# EAGLE schematic DoomPlayer (EAGLE 9.6.2)
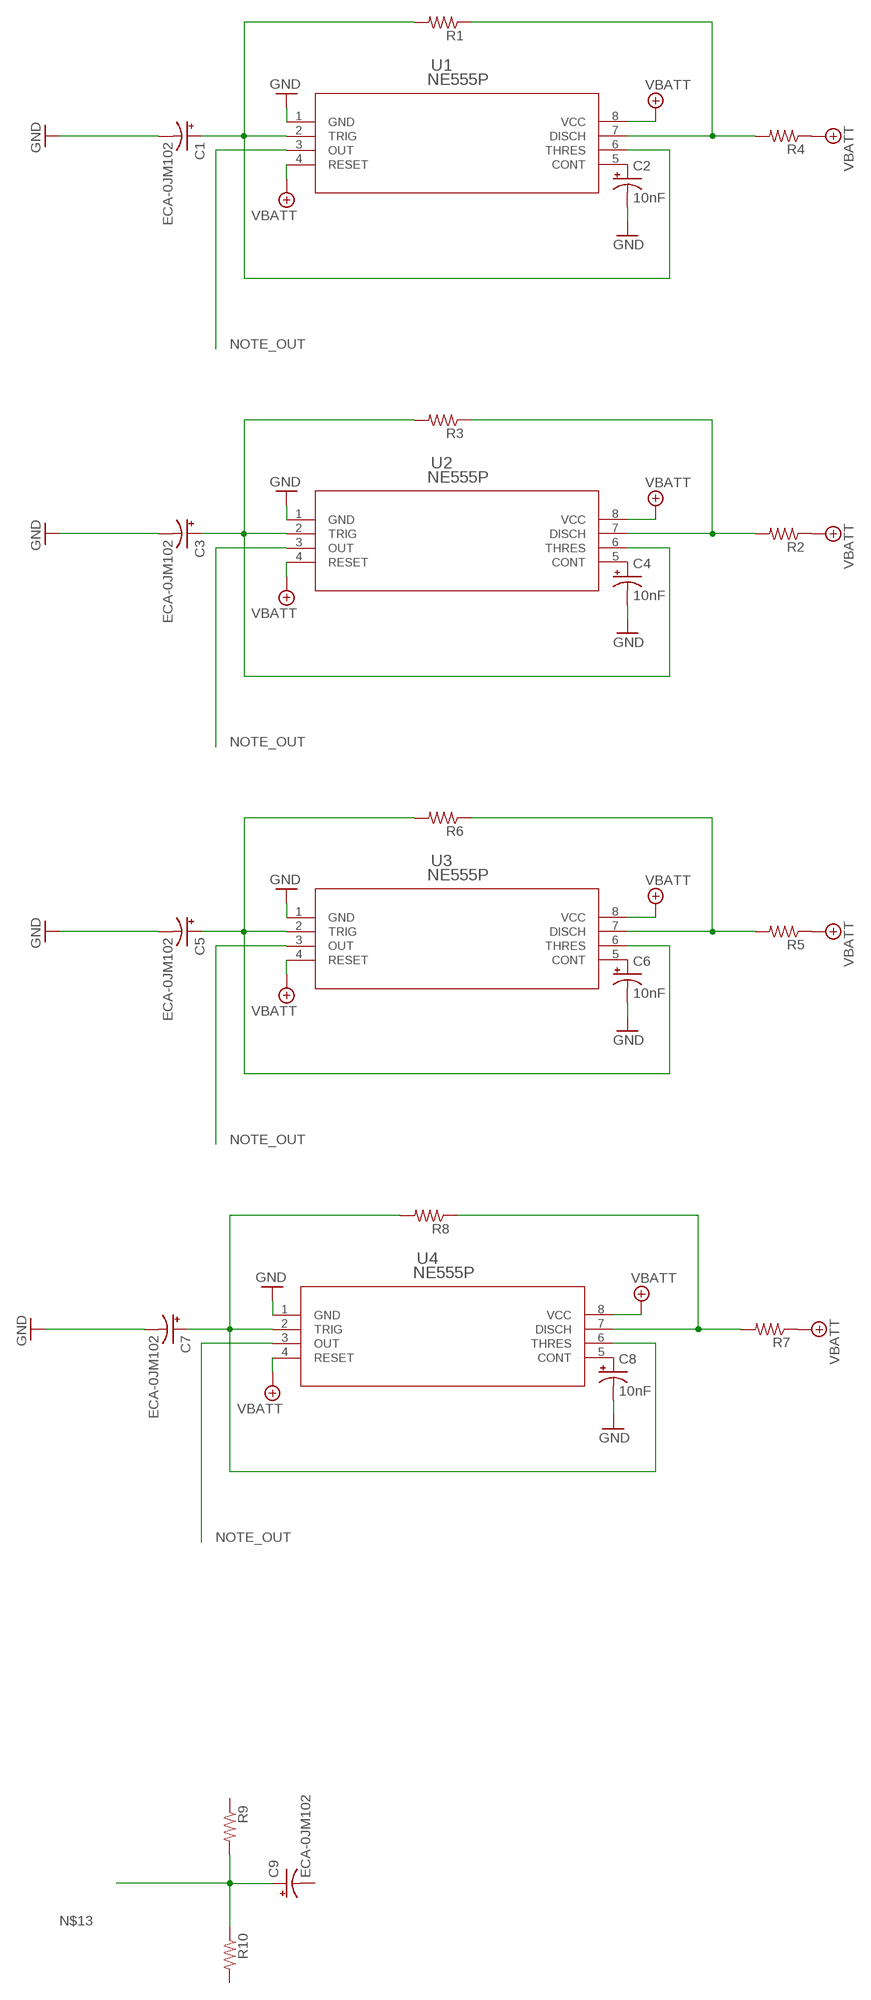
[diagram p0: schematic, sheet 1]

## Parts
C1  ECA-0JM102  [PCAP_8X112]
C2  10nF  ECA-0JM102  [PCAP_8X112]
C3  ECA-0JM102  [PCAP_8X112]
C4  10nF  ECA-0JM102  [PCAP_8X112]
C5  ECA-0JM102  [PCAP_8X112]
C6  10nF  ECA-0JM102  [PCAP_8X112]
C7  ECA-0JM102  [PCAP_8X112]
C8  10nF  ECA-0JM102  [PCAP_8X112]
C9  ECA-0JM102  [PCAP_8X112]
R1  ERJ-L06KF50MV  [RC0805N]
R2  ERJ-L06KF50MV  [RC0805N]
R3  ERJ-L06KF50MV  [RC0805N]
R4  ERJ-L06KF50MV  [RC0805N]
R5  ERJ-L06KF50MV  [RC0805N]
R6  ERJ-L06KF50MV  [RC0805N]
R7  ERJ-L06KF50MV  [RC0805N]
R8  ERJ-L06KF50MV  [RC0805N]
R9  ERJ-L06KF50MV  [RC0805N]
R10  ERJ-L06KF50MV  [RC0805N]
U1  NE555P  [P8]
U2  NE555P  [P8]
U3  NE555P  [P8]
U4  NE555P  [P8]

## Nets
GND: C1.2(-) C2.2(-) C3.2(-) C4.2(-) C5.2(-) C6.2(-) C7.2(-) C8.2(-) U1.1(GND) U2.1(GND) U3.1(GND) U4.1(GND)
N$1: C3.1(+) R3.2(PIN2) U2.2(TRIG) U2.6(THRES)
N$2: C1.1(+) R1.2(PIN2) U1.2(TRIG) U1.6(THRES)
N$3: R1.1(PIN1) R4.2(PIN2) U1.7(DISCH)
N$4: C2.1(+) U1.5(CONT)
N$5: R2.2(PIN2) R3.1(PIN1) U2.7(DISCH)
N$6: C4.1(+) U2.5(CONT)
N$7: C5.1(+) R6.2(PIN2) U3.2(TRIG) U3.6(THRES)
N$8: R5.2(PIN2) R6.1(PIN1) U3.7(DISCH)
N$9: C6.1(+) U3.5(CONT)
N$10: C7.1(+) R8.2(PIN2) U4.2(TRIG) U4.6(THRES)
N$11: R7.2(PIN2) R8.1(PIN1) U4.7(DISCH)
N$12: C8.1(+) U4.5(CONT)
N$13: C9.1(+) R9.2(PIN2) R10.1(PIN1)
NOTE_OUT: U1.3(OUT) U2.3(OUT) U3.3(OUT) U4.3(OUT)
VBATT: R2.1(PIN1) R4.1(PIN1) R5.1(PIN1) R7.1(PIN1) U1.4(RESET) U1.8(VCC) U2.4(RESET) U2.8(VCC) U3.4(RESET) U3.8(VCC) U4.4(RESET) U4.8(VCC)
Unconnected: C9.2(-) R9.1(PIN1) R10.2(PIN2)

## Library data of the parts
C1-C9 = RoboJackets-Capacitors:ECA-0JM102: https://www.digikey.com/product-detail/en/panasonic-electronic-components/ECA-0JM102/P5115-ND/244974; MANUFACTURER_PART_NUMBER: ECA0JM102; VENDOR: Panasonic
R1-R10 = RoboJackets-Resistors:ERJ-L06KF50MV: Current Sensing Resistor Datasheet <https://industrial.panasonic.com/cdbs/www-data/pdf/RDN0000/AOA0000C313.pdf>; DKPN: P50LLCT-ND
U1-U4 = PCB_Challenge_Custom:NE555P; DATASHEET_URL: http://www.ti.com/lit/gpn/NE555; DESCRIPTION: Single Precision Timer; FAMILY_NAME: TIMERS(CT); GENERIC_PART_NUMBER: NE555; INDUSTRY_STD_PKG_TYPE: PDIP; MANUFACTURER: Texas Instruments; PACKAGE_DESIGNATOR: P; PIN_COUNT: 8